# Altium schematic sheet schem.SchDoc
size A
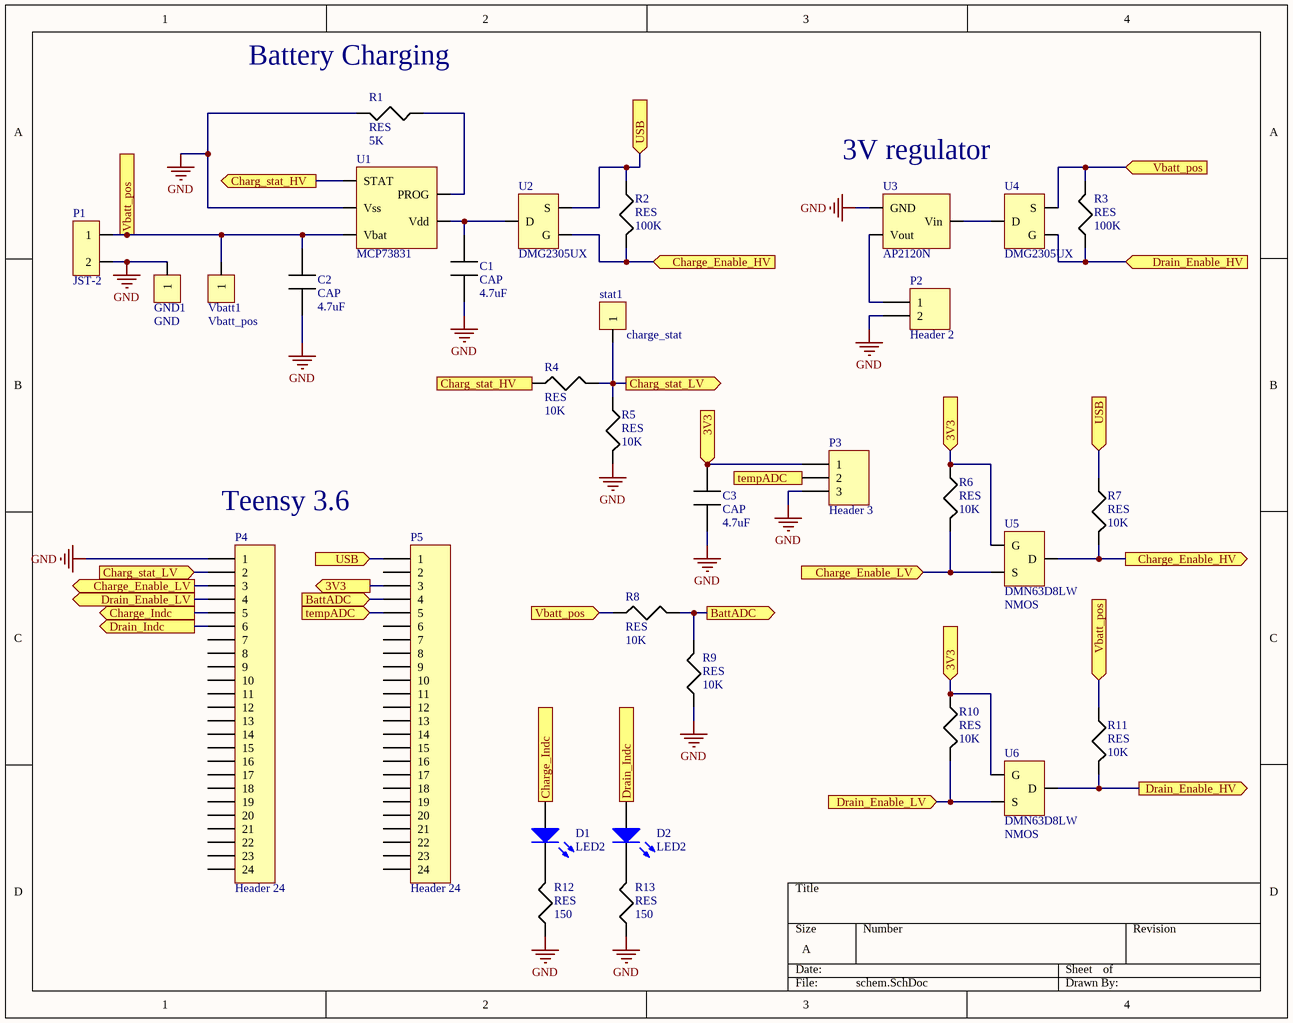
[diagram p0: schem.SchDoc]

## Parts
C1  CAP  value 4.7uF  [Cap 0603 (1608 metric)]
C2  CAP  value 4.7uF  [Cap 0603 (1608 metric)]
C3  CAP  value 4.7uF  [Cap 0603 (1608 metric)]
D1  LED2  [3.2X1.6X1.1]
D2  LED2  [3.2X1.6X1.1]
GND1  GND  [test pad]
P1  JST-2  [JST-2 SMT]
P2  Header 2  [HDR1X2]
P3  Header 3  [HDR1X3]
P4  Header 24  [HDR1X24]
P5  Header 24  [HDR1X24]
R1  RES  value 5K  [Res 0603 (1608 metric)]
R2  RES  value 100K  [Res 0603 (1608 metric)]
R3  RES  value 100K  [Res 0603 (1608 metric)]
R4  RES  value 10K  [Res 0603 (1608 metric)]
R5  RES  value 10K  [Res 0603 (1608 metric)]
R6  RES  value 10K  [Res 0603 (1608 metric)]
R7  RES  value 10K  [Res 0603 (1608 metric)]
R8  RES  value 10K  [Res 0603 (1608 metric)]
R9  RES  value 10K  [Res 0603 (1608 metric)]
R10  RES  value 10K  [Res 0603 (1608 metric)]
R11  RES  value 10K  [Res 0603 (1608 metric)]
R12  RES  value 150  [Res 0603 (1608 metric)]
R13  RES  value 150  [Res 0603 (1608 metric)]
stat1  charge_stat  [test pad]
U1  MCP73831  [SOT23127P600-8N]
U2  DMG2305UX  [SOT105P240X110-3N]
U3  AP2120N  [AP2120]
U4  DMG2305UX  [SOT105P240X110-3N]
U5  DMN63D8LW  [DMN63D8LW]
U6  DMN63D8LW  [DMN63D8LW]
Vbatt1  Vbatt_pos  [test pad]

## Ports
3V3 (in), 3V3 (out), BattADC (in), BattADC (out), Charg_stat_HV (in), Charg_stat_HV (out), Charg_stat_LV (in), Charg_stat_LV (out), Charge_Enable_HV (in), Charge_Enable_HV (out), Charge_Enable_LV (in), Charge_Enable_LV (out), Charge_Indc (in), Charge_Indc (out), Drain_Enable_HV (in), Drain_Enable_HV (out), Drain_Enable_LV (in), Drain_Enable_LV (out), Drain_Indc (in), Drain_Indc (out), tempADC (in), USB (in), Vbatt_pos (in), Vbatt_pos (out)

## Nets
GND: C1.1 C2.1 C3.1 GND1.1 P1.2 P2.2 P3.3 P4.1 R1.2 R5.2 R9.1 R12.1 R13.1 U1.2(Vss) U3.1(GND)
3V3: C3.2 P3.1 P5.3 R6.1 R10.1 U5.1(G) U6.1(G) ; port 3V3
BattADC: P5.4 R8.2 R9.2 ; port BattADC
Charg_stat_HV: R4.1 U1.1(STAT) ; port Charg_stat_HV
Charg_stat_LV: P4.2 R4.2 R5.1 stat1.1 ; port Charg_stat_LV
Charge_Enable_HV: R2.2 R7.2 U2.1(G) U5.3(D) ; port Charge_Enable_HV
Charge_Enable_LV: P4.3 R6.2 U5.2(S) ; port Charge_Enable_LV
Charge_Indc: D1.1(A) P4.5 ; port Charge_Indc
Drain_Enable_HV: R3.1 R11.2 U4.1(G) U6.3(D) ; port Drain_Enable_HV
Drain_Enable_LV: P4.4 R10.2 U6.2(S) ; port Drain_Enable_LV
Drain_Indc: D2.1(A) P4.6 ; port Drain_Indc
tempADC: P3.2 P5.5 ; port tempADC
USB: P5.1 R2.1 R7.1 U2.2(S) ; port USB
Vbatt_pos: C2.2 P1.1 R3.2 R8.1 R11.1 U1.3(Vbat) U4.2(S) Vbatt1.1 ; port Vbatt_pos
NetC1_2: C1.2 U1.4(Vdd) U2.3(D)
NetD1_2: D1.2(K) R12.2
NetD2_2: D2.2(K) R13.2
NetP2_1: P2.1 U3.2(Vout)
NetR1_1: R1.1 U1.5(PROG)
NetU3_3: U3.3(Vin) U4.3(D)

Not connected (* = marked no-connect by the designer): P4 7 8 9 10 11 12 13 14 15 16 17 18 19 20 21 22 23 24; P5 2 6 7 8 9 10 11 12 13 14 15 16 17 18 19 20 21 22 23 24

## Notes on the sheet
- (near R1) Battery Charging
- 3V regulator
- Teensy 3.6
- (in symbol DMN63D8LW) NMOS

## Library data of the parts
D1 D2 = LED2: Typical RED, GREEN, YELLOW, AMBER GaAs LED; Published: 8-Jun-2000; LatestRevisionDate: 17-Jul-2002; LatestRevisionNote: Re-released for DXP Platform.; PackageVersion: Feb-2002; PackageReference: 3.2X1.6X1.1; Publisher: Altium Limited; PackageDescription: SM LED; 2 Flat Leads
GND1 stat1 Vbatt1 = test_pad: test pad
P2 = Header 2: Header, 2-Pin; LatestRevisionDate: 17-Jul-2002; LatestRevisionNote: Re-released for DXP Platform.; Publisher: Altium Limited
P3 = Header 3: Header, 3-Pin; LatestRevisionDate: 17-Jul-2002; LatestRevisionNote: Re-released for DXP Platform.; Publisher: Altium Limited
P4 P5 = Header 24: Header, 24-Pin; LatestRevisionDate: 17-Jul-2002; LatestRevisionNote: Re-released for DXP Platform.; Publisher: Altium Limited
U1 = MCP73831: Li-Charge Management Controllers
U2 U4 = DMG2305UX: P-MOSFET
U3 = AP2120N: 3.0V regulator
U5 U6 = DMN63D8LW: N-MOSFET SOT-323